# Altium schematic sheet DC-DC.SchDoc
size A4; SheetNumber: 1; SheetTotal: 1
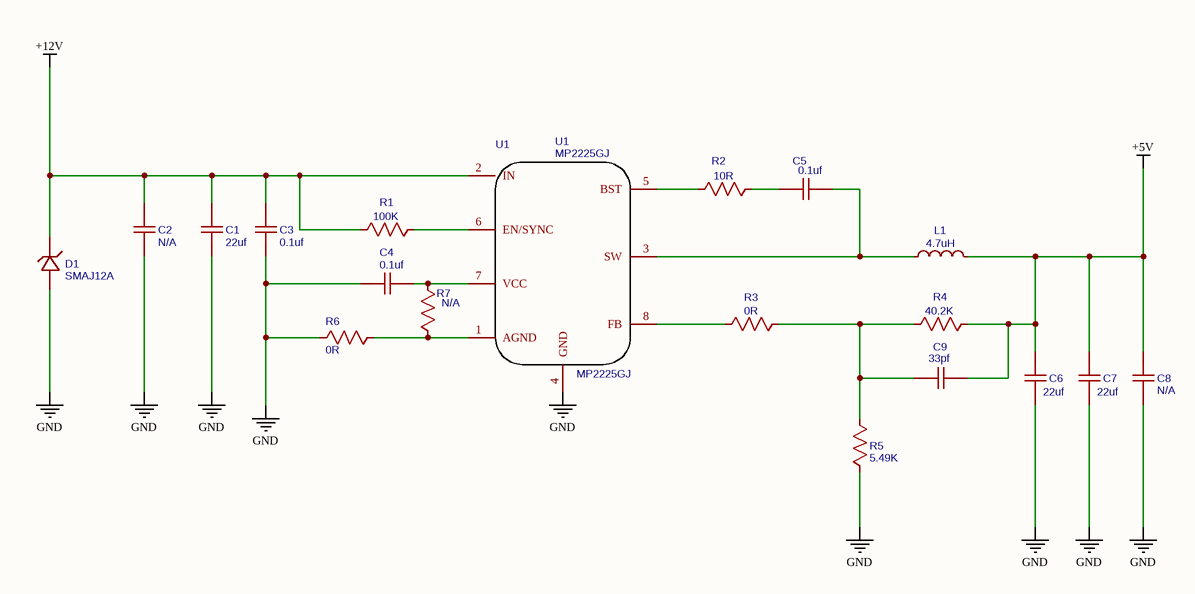
[diagram p0: DC-DC.SchDoc]

## Parts
C1  22uf  [C1206]
C2  N/A  [C1206]
C3  0.1uf  [C0603]
C4  0.1uf  [C0603]
C5  0.1uf  [C0603]
C6  22uf  [C0805]
C7  22uf  [C0805]
C8  N/A  [C0805]
C9  33pf  [C0603]
D1  SMAJ12A  [SMA_L4.4-W2.8-LS5.4-RD]
L1  4.7uH  [IND-SMD_L7.8-W7.0_MAPM0630F]
R1  100K  [R0603]
R2  10R  [R0603]
R3  0R  [R0603]
R4  40.2K  [R0603]
R5  5.49K  [R0603]
R6  0R  [R0603]
R7  N/A  [R0603]
U1  MP2225GJ  [TSOT23-8]

## Nets
+5V: C6.2 C7.2 C8.2 C9.2 L1.2 R4.2
+12V: C1.2 C2.2 C3.2 D1.1 R1.1 U1.2(IN)
GND: C1.1 C2.1 C3.1 C4.1 C6.1 C7.1 C8.1 D1.2 R5.1 R6.1 U1.4(GND)
NetC4_2: C4.2 R7.1 U1.7(VCC)
NetC5_1: C5.1 R2.2
NetC5_2: C5.2 L1.1 U1.3(SW)
NetC9_1: C9.1 R3.2 R4.1 R5.2
NetR1_2: R1.2 U1.6(EN/SYNC)
NetR2_1: R2.1 U1.5(BST)
NetR3_1: R3.1 U1.8(FB)
NetR6_2: R6.2 R7.2 U1.1(AGND)

## Library data of the parts
C1 C6 C7 = 22uf: nameAlias: Value(F); Contributor: LCEDA_Lib; spicePre: C
  C1: spiceSymbolName: C_1206_US
  C6 C7: spiceSymbolName: C_0805_US
C2 C8 = N/A: nameAlias: Value(F); Contributor: LCEDA_Lib; spicePre: C
  C2: spiceSymbolName: C_1206_US
  C8: spiceSymbolName: C_0805_US
C3-C5 = 0.1uf: nameAlias: Value(F); Contributor: LCEDA_Lib; spicePre: C; spiceSymbolName: C_0603_US
C9 = 33pf: nameAlias: Value(F); Contributor: LCEDA_Lib; spicePre: C; spiceSymbolName: C_0603_US
D1 = SMAJ12A: BOM_Manufacturer: Brightking Elec (TAIWAN); BOM_Manufacturer Part: SMAJ70A; Contributor: LCSC; BOM_Supplier: LCSC; BOM_Supplier Part: C309908; BOM_JLCPCB Part Class: Extended Part; spicePre: D; spiceSymbolName: SMAJ70A
L1 = 4.7uH: BOM_Manufacturer: Jinlai; BOM_Manufacturer Part: JSHC0630H-150M-G; nameAlias: Inductance; Contributor: LCSC; BOM_Supplier: LCSC; BOM_Supplier Part: C334085; spicePre: L; spiceSymbolName: JSHC0630H-150M-G
R1 R6 R7 = 100K: nameAlias: Value(Ω); Contributor: LCEDA_Lib; spicePre: R; spiceSymbolName: R_0603_US
R2 = 10R: nameAlias: Value(Ω); Contributor: LCEDA_Lib; spicePre: R; spiceSymbolName: R_0603_US
R3 = 0R: nameAlias: Value(Ω); Contributor: LCEDA_Lib; spicePre: R; spiceSymbolName: R_0603_US
R4 = 40.2K: nameAlias: Value(Ω); Contributor: LCEDA_Lib; spicePre: R; spiceSymbolName: R_0603_US
R5 = 5.49K: nameAlias: Value(Ω); Contributor: LCEDA_Lib; spicePre: R; spiceSymbolName: R_0603_US
U1 = MP2225GJ: Contributor: sunhaoqin; link: https://www.monolithicpower.com/en/documentview/productdocument/index/version/2/document_type/Datasheet/lang/en/sku/MP2225GJ-Z/document_id/922/; spicePre: U; spiceSymbolName: MP2225GJ